# Altium schematic sheet pixracer_sd_usb_can_i2c.SchDoc
size A4; SheetNumber: 3; SheetTotal: 5
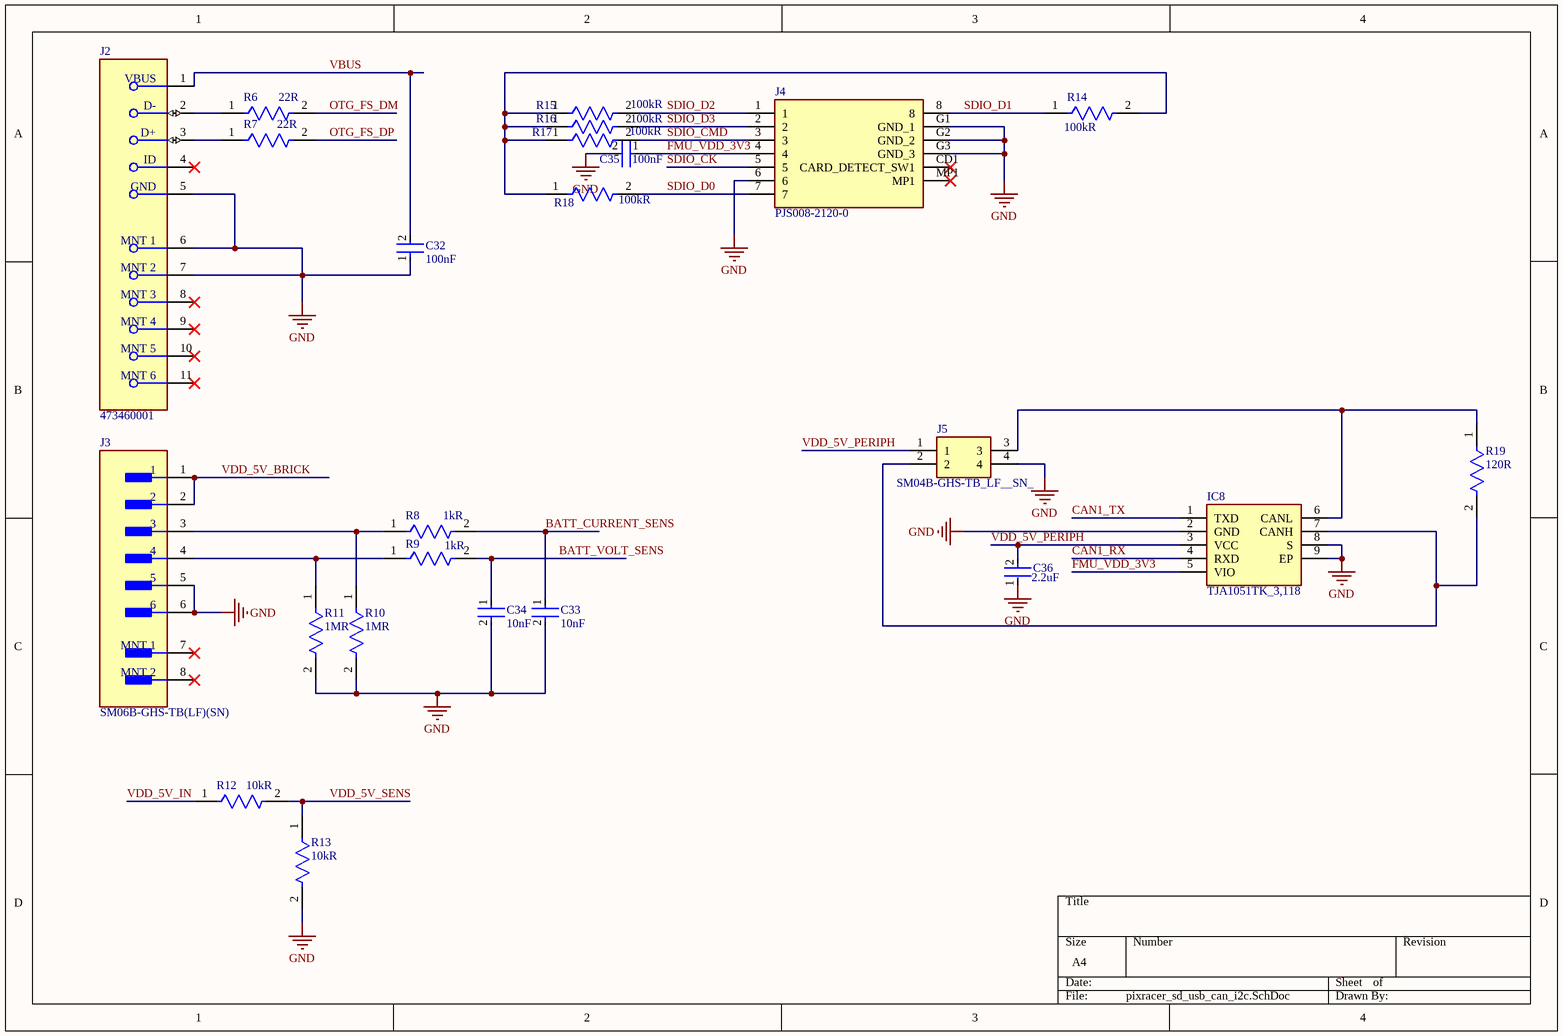
[diagram p0: pixracer_sd_usb_can_i2c.SchDoc]

## Parts
C32  Capacitance: 100nF  [FP-0603-L_1_6_0_15-W_0_81-IPC_B]  (hidden comment: 0603ZC104MAT2A)
C33  Capacitance: 10nF  [FP-C1608-080-0_1-MFG]  (hidden comment: C1608X5R1H103K080AA)
C34  Capacitance: 10nF  [FP-C1608-080-0_1-MFG]  (hidden comment: C1608X5R1H103K080AA)
C35  Capacitance: 100nF  [FP-0603-L_1_6_0_15-W_0_81-IPC_B]  (hidden comment: 0603ZC104MAT2A)
C36  Capacitance: 2.2uF  [FP-C1608-080-0_1-MFG]  (hidden comment: C1608X7R1A225K080AC)
IC8  TJA1051TK_3,118  [SON65P300X300X100-9N-D]
J2  473460001  [FP-473460001-MFG]
J3  SM06B-GHS-TB(LF)(SN)  [FP-SM06B-GHS-TB_LF_SN-MFG]
J4  PJS008-2120-0  [PJS00821200]
J5  SM04B-GHS-TB_LF__SN_  [SM04B-GHS-TB]
R6  Resistance: 22R  [FP-CRCW0603-HPe3-IPC_A]  (hidden comment: CRCW060322R0JNEAHP)
R7  Resistance: 22R  [FP-CRCW0603-HPe3-IPC_A]  (hidden comment: CRCW060322R0JNEAHP)
R8  Resistance: 1kR  [FP-RC1608-IPC_A]  (hidden comment: RC1608J102CS)
R9  Resistance: 1kR  [FP-RC1608-IPC_A]  (hidden comment: RC1608J102CS)
R10  Resistance: 1MR  [FP-CRCW0603-HPe3-IPC_A]  (hidden comment: CRCW06031M00JNEAHP)
R11  Resistance: 1MR  [FP-CRCW0603-HPe3-IPC_A]  (hidden comment: CRCW06031M00JNEAHP)
R12  Resistance: 10kR  [FP-ERJ3G-IPC_C]  (hidden comment: ERJ-3GEYJ103V)
R13  Resistance: 10kR  [FP-ERJ3G-IPC_C]  (hidden comment: ERJ-3GEYJ103V)
R14  Resistance: 100kR  [FP-RMCF0603-IPC_C]  (hidden comment: RMCF0603JT100K)
R15  Resistance: 100kR  [FP-RMCF0603-IPC_C]  (hidden comment: RMCF0603JT100K)
R16  Resistance: 100kR  [FP-RMCF0603-IPC_C]  (hidden comment: RMCF0603JT100K)
R17  Resistance: 100kR  [FP-RMCF0603-IPC_C]  (hidden comment: RMCF0603JT100K)
R18  Resistance: 100kR  [FP-RMCF0603-IPC_C]  (hidden comment: RMCF0603JT100K)
R19  Resistance: 120R  [FP-MCT0603-MFG]  (hidden comment: MCT06030D1200BP100)

## Nets
GND: C32.1 C33.2 C34.2 C35.2 C36.1 IC8.2(GND) IC8.8(S) IC8.9(EP) J2.5(GND) J2.6(MNT_1) J2.7(MNT_2) J3.5 J3.6 J4.6 J4.G1(GND_1) J4.G2(GND_2) J4.G3(GND_3) J5.4 R10.2 R11.2 R13.2
BATT_CURRENT_SENS: C33.1 R8.2
BATT_VOLT_SENS: C34.1 R9.2
CAN1_RX: IC8.4(RXD)
CAN1_TX: IC8.1(TXD)
FMU_VDD_3V3: C35.1 IC8.5(VIO) J4.4
OTG_FS_DM: R6.2
OTG_FS_DP: R7.2
SDIO_CK: J4.5
SDIO_CMD: J4.3 R17.2
SDIO_D0: J4.7 R18.2
SDIO_D1: J4.8 R14.1
SDIO_D2: J4.1 R15.2
SDIO_D3: J4.2 R16.2
VBUS: C32.2 J2.1(VBUS)
VDD_5V_BRICK: J3.1 J3.2
VDD_5V_IN: R12.1
VDD_5V_PERIPH: C36.2 IC8.3(VCC) J5.1
VDD_5V_SENS: R12.2 R13.1
NetIC8_6: IC8.6(CANL) J5.3 R19.1
NetIC8_7: IC8.7(CANH) J5.2 R19.2
NetJ2_2: J2.2(D-) R6.1
NetJ2_3: J2.3(D+) R7.1
NetJ3_3: J3.3 R8.1 R10.1
NetJ3_4: J3.4 R9.1 R11.1
NetR14_2: R14.2 R15.1 R16.1 R17.1 R18.1

Not connected (* = marked no-connect by the designer): J2 4(ID)* 8(MNT_3)* 9(MNT_4)* 10(MNT_5)* 11(MNT_6)*; J3 7(MNT_1)* 8(MNT_2)*; J4 CD1(CARD_DETECT_SW1)* MP1*

## Library data of the parts
C32 C35 = CMP-2006-04550-2: General Purpose Ceramic Capacitor, 0603, 100nF, 20%, X7R, 15%, 10V; Mount: Surface Mount; Package Quantity: 4000; RoHS Compliant: Yes; Case Code (Imperial): 0603; Voltage Rating: 10V; Packaging: Tape and Reel; Series: -; Tolerance: 20%; Thickness: 0.035inch; Number of Pins: 2; Min Operating Temperature: -55°C; Case/Package: 0603; Length: 1.6mm; Radiation Hardening: No; Voltage Rating (DC): 10V; Depth: 0.81mm; Lead Pitch: 0.014inch; Termination: SMD/SMT; Case Code (Metric): 1608; Construction: Flat; Width: 0.032inch; Lead Free: Lead Free; Max Operating Temperature: 125°C; Dielectric: X7R
C33 C34 = CMP-08246-005900-1: Multilayer Ceramic Capacitors 10nF ±10% 50V X5R SMD 0603; Package Quantity: 4000; Thickness: 0.035inch; Tolerance: 10%; Min Operating Temperature: -55°C; Max Operating Temperature: 85°C; Length: 0.063inch; Dielectric Material: Ceramic; Width: 0.031inch; Series: C; Case Code (Metric): 1608; Case Code (Imperial): 0603; RoHS Compliant: Yes; Lead Free: Lead Free; Voltage Rating (DC): 50V; Mount: Surface Mount; Case/Package: 0603; Voltage Rating: 50V; Packaging: Tape and Reel
C36 = CMP-08246-006835-1: Multilayer Ceramic Capacitors 2.2μF ±10% 10V X7R SMD 0603; Lead Free: Lead Free; Mount: Surface Mount; Case Code (Metric): 1608; Construction: Flat; Packaging: Tape and Reel; REACH SVHC: No SVHC; Weight: 7.1E-05oz; Resistor Type: Ceramic; Package Quantity: 4000; Voltage Rating (DC): 10V; Case/Package: 0603; Termination: SMD/SMT; Case Code (Imperial): 0603; Series: C; Voltage Rating: 10V; Min Operating Temperature: -55°C; Dielectric Material: Ceramic; Length: 1.6mm; Tolerance: 10%; Depth: 0.8mm; Width: 0.031inch; Dielectric: X7R; Max Operating Temperature: 125°C; RoHS Compliant: Yes; Height: 0.8mm; Thickness: 0.037inch
IC8 = TJA1051TK_3,118: Integrated Circuit; Manufacturer_Name: NXP; Manufacturer_Part_Number: TJA1051TK/3,118; Datasheet Link: http://www.nxp.com/docs/en/data-sheet/TJA1051.pdf; Height: 1mm; Mouser Part Number: 771-TJA1051TK/3118; Mouser Price/Stock: https://www.mouser.co.uk/ProductDetail/NXP-Semiconductors/TJA1051TK-3118?qs=fhAOlxDPaYVrDQ2e4g%252BBJA%3D%3D; Arrow Part Number: TJA1051TK/3,118; Arrow Price/Stock: https://www.arrow.com/en/products/tja1051tk3118/nxp-semiconductors?region=nac
J2 = CMP-2000-05246-2: CONN RCPT USB2.0 MICRO B SMD R/A; Manufacturer: Molex; Conn Orientation: Right Angle; Is Female: yes; Shielding: true; Pitch: 0.65mm; Number Of Contacts: 5; Voltage Rating: 30V; Current Rating: 1.8A; Device Class L2: USB Connectors; Digikey Description: CONN RCPT USB2.0 MICRO B SMD R/A; Height: 2.945mm; RoHS: TRUE; ComponentLink2Description: Datasheet; Octopart: https://octopart.com/47346-0001-molex-7164928; Automotive: No; Package: 0; Category: Conn; Device Class L1: Connectors; Usb Standard: USB 2.0; Temperature: -30°C to +85°C; Temperature Range Low: -30°C; Footprint Url: https://www.molex.com/pdm_docs/sd/473460001_sd.pdf; ComponentLink2URL: https://www.molex.com/webdocs/datasheets/pdf/en-us/0473460001_IO_CONNECTORS.pdf; Lead Free: Yes; Manufacturer Part Number: 473460001; Contact Material: Gold,Nickel; Temperature Range High: +85°C; Device Class L3: unset
J3 = CMP-17439-000061-1: CONN HEADER SMD R/A 6POS 1.25MM; Number of Contacts: 6; Voltage Rating: 50V; Current Rating: 1A; Connector Type: Outer Shroud Contact; Contact Resistance: 50mR; Orientation: Right Angle; Max Operating Temperature: 85°C; Mount: Surface Mount; Packaging: Tape and Reel; Contact Plating: Tin; Depth: 4.05mm; Max Voltage Rating (AC): 50V; Lead Free: Lead Free; Pitch: 1.25mm; Number of Positions: 6; Max Current Rating: 1A; Termination: Solder; Min Operating Temperature: -25°C; Housing Color: Beige; Fastening Type: Ramp; Length: 10.75mm; Color: Natural; Contact Material: Bronze; Housing Material: Polyamide; Number of Rows: 1
J4 = PJS008-2120-0: Connector; Manufacturer_Name: Yamaichi; Datasheet Link: https://componentsearchengine.com/Datasheets/1/PJS008-2120-0.pdf; Height: 1.5mm; Manufacturer_Part_Number: PJS008-2120-0; Mouser Part Number: 945-PJS008-2120-0; Mouser Price/Stock: https://www.mouser.co.uk/ProductDetail/Yamaichi-Electronics/PJS008-2120-0?qs=pDnM3xHIg41mTHT1wk7bvQ%3D%3D
J5 = SM04B-GHS-TB_LF__SN_: Connector; Manufacturer_Name: JST (JAPAN SOLDERLESS TERMINALS); Manufacturer_Part_Number: SM04B-GHS-TB(LF)(SN); Datasheet Link: http://uk.rs-online.com/web/p/products/7521797
R6 R7 = CMP-02407-008302-1: RES Thick Film, 22Ω, 5%, 0.33W, 200ppm/°C, 0603; Voltage Rating: 75V; Power Rating: 250mW; Min Operating Temperature: -55°C; Weight: 7.1E-05oz; Max Operating Temperature: 155°C; Contact Plating: Tin; Tolerance: 5%; Package Quantity: 5000; Length: 1.6mm; Case Code (Imperial): 0603; Radiation Hardening: No; Lead Free: Lead Free; Case/Package: 0603; Mount: Surface Mount; Depth: 0.85mm; Height: 0.45mm; Military Standard: Not; Temperature Coefficient: 200ppm/°C; Packaging: Tape and Reel; Case Code (Metric): 1608; Composition: Thick Film; Width: 0.8mm
R8 R9 = CMP-13261-002301-1: Res Thick Film 0603 1kΩ 5% 0.1W ±100ppm/°C Molded SMD T/R; Power Rating: 100mW; Voltage Rating (DC): 50V; Contact Plating: Tin; Mount: Surface Mount; Number of Terminations: 2; Features: Moisture Resistant; Max Power Dissipation: 100mW; Military Standard: Not; Case/Package: 0603; Radiation Hardening: No; Temperature Coefficient: 100ppm/°C; Length: 1.6mm; Height: 0.022inch; Case Code (Metric): 1608; Max Operating Temperature: 155°C; Composition: Thick Film; Tolerance: 5%; Width: 0.031inch; Depth: 0.8mm; Packaging: Tape and Reel; Lead Free: Lead Free; Case Code (Imperial): 0603; Min Operating Temperature: -55°C
R10 R11 = CMP-02407-009732-1: RES Thick Film, 1MΩ, 5%, 0.33W, 200ppm/°C, 0603; Max Power Dissipation: 250mW; Voltage Rating: 75V; Case Code (Imperial): 0603; Radiation Hardening: No; Length: 0.063inch; Tolerance: 5%; Features: Automotive AEC-Q200; Number of Terminations: 2; Height: 0.022inch; Max Operating Temperature: 155°C; Lead Free: Lead Free; Packaging: Tape and Reel; Case/Package: 0603; Weight: 7.1E-05oz; Width: 0.8mm; Min Operating Temperature: -55°C; Termination: SMD/SMT; Package Quantity: 1; Case Code (Metric): 1608; Composition: Thick Film; Temperature Coefficient: 200ppm/°C; Power Rating: 250mW; Contact Plating: Tin
R12 R13 = CMP-2000-00704-2: RES SMD 10K OHM 5% 1/10W 0603; Temperature Coefficient: 200ppm/°C; Max Power Dissipation: 100mW; Voltage Rating (DC): 50V; Voltage Rating: 75V; Resistor Type: Thick Film; Tolerance: 5%; Military Standard: Not; Package Quantity: 1; Max Operating Temperature: 155°C; Mount: Surface Mount; Technology: THICK FILM; Case/Package: 0603; Construction: Rectangular; Depth: 0.8mm; Case Code (Imperial): 0603; Weight: 7.1E-05oz; Features: Automotive AEC-Q200; Packaging: Tape and Reel; Width: 0.8mm; Length: 1.6mm; Termination: SMD/SMT; Power Rating: 100mW; Lead Free: Lead Free; Number of Terminations: 2; Height: 0.45mm; RoHS Compliant: Yes; Min Operating Temperature: -55°C; Contact Plating: Tin; REACH SVHC: No SVHC; Resistance Tolerance: 5%; Series: ERJ; Working Voltage: 75V; Case Code (Metric): 1608
R14-R18 = CMP-26527-000115-1: 100kΩ ±5% 0.1W 0603 Thick Film Chip Resistor AEC-Q200 compliant; Max Power Dissipation: 100mW; Temperature Coefficient: 100ppm/°C; Resistor Type: Thick Film; Height: 0.022inch; Features: Automotive AEC-Q200; Contact Plating: Tin; Lead Free: Lead Free; Number of Terminations: 2; Radiation Hardening: No; Military Standard: Not; Power Rating: 100mW; Mount: Surface Mount; Case Code (Imperial): 0603; Case Code (Metric): 1608; Depth: 0.8mm; Construction: Rectangular; Width: 0.031inch; RoHS Compliant: Yes; Length: 1.55mm; Max Operating Temperature: 155°C; Min Operating Temperature: -55°C; Case/Package: 0603; Tolerance: 5%; Series: RMCF; Packaging: Tape and Reel
R19 = CMP-02407-011907-1: RES SMD 100 OHM 1% 1/8W 0603; Temperature Coefficient: 25ppm/°C; Power Rating: 100mW; Tolerance: 0.1%; Military Standard: Not; RoHS Compliant: Yes; Packaging: Tape and Reel; Contact Plating: Tin; Min Operating Temperature: -55°C; Lead Free: Lead Free; Height: 0.45mm; Depth: 0.85mm; Width: 850um; Mount: Surface Mount; Number of Terminations: 2; Size Code: 0603; Max Power Dissipation: 100mW; Case/Package: 0603; Radiation Hardening: No; Technology: THIN FILM; Construction: Rectangular; Max Operating Temperature: 125°C; Resistor Type: Thin Film; Length: 1.55mm; Features: Anti-Sulfur; Series: MCT - Precision